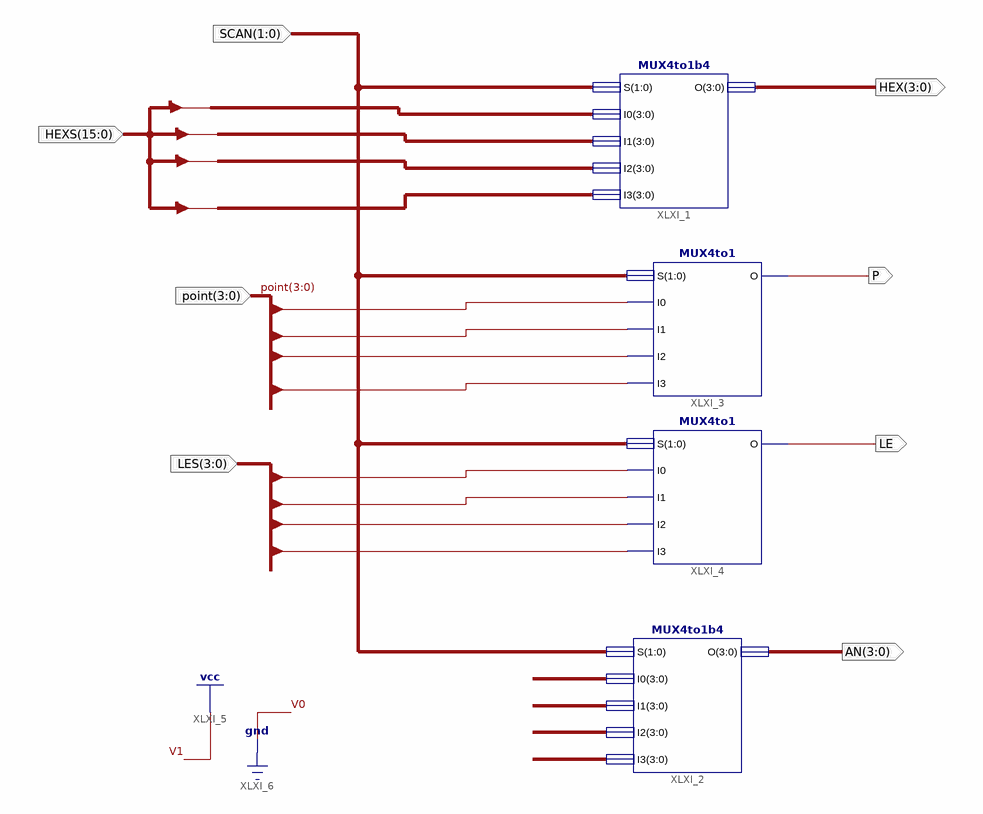
[diagram p0: schematic sheet 1]
// Xilinx ISE schematic DisplaySync.sch (kintex7) as structural Verilog: 4 symbols, 8 ports
module DisplaySync (
  input  [1:0] SCAN,
  input  [15:0] HEXS,
  input  [3:0] point,
  input  [3:0] LES,
  output [3:0] AN,
  output LE,
  output P,
  output [3:0] HEX
);

  MUX4to1b4 XLXI_1 (.S(SCAN), .I0(HEXS[3:0]), .I1(HEXS[7:4]), .I2(HEXS[11:8]), .I3(HEXS[15:12]), .O(HEX));
  MUX4to1b4 XLXI_2 (.S(SCAN), .I0(4'b1110), .I1(4'b1101), .I2(4'b1011), .I3(4'b0111), .O(AN));
  MUX4to1 XLXI_3 (.S(SCAN), .I0(point[0]), .I1(point[1]), .I2(point[2]), .I3(point[3]), .O(P));
  MUX4to1 XLXI_4 (.S(SCAN), .I0(LES[0]), .I1(LES[1]), .I2(LES[2]), .I3(LES[3]), .O(LE));
endmodule
